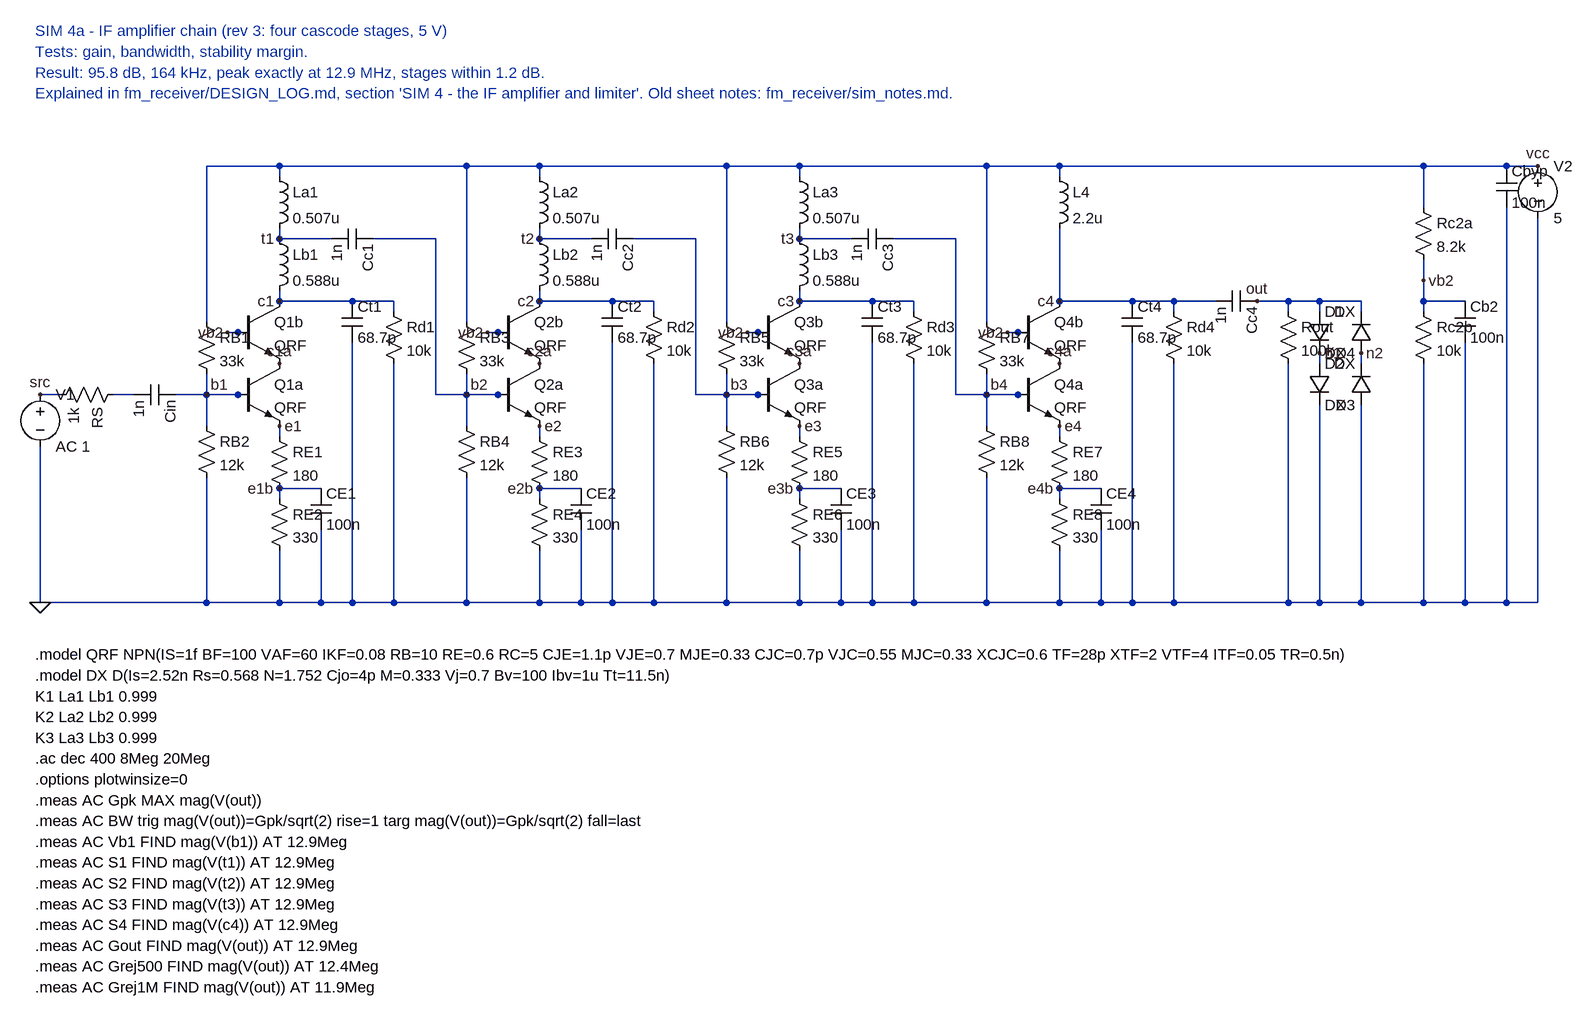
[diagram p0: schematic sim4a_if_gain.asc]
sim4a_if_gain.asc, the LTspice schematic file:
Version 4
SHEET 1 2600 1800
WIRE 336 48 448 48
WIRE 448 48 736 48
WIRE 736 48 848 48
WIRE 848 48 1136 48
WIRE 1136 48 1248 48
WIRE 1248 48 1536 48
WIRE 1536 48 1648 48
WIRE 1648 48 2208 48
WIRE 2208 48 2336 48
WIRE 2336 48 2384 48
WIRE 336 48 336 288
WIRE 448 48 448 64
WIRE 736 48 736 288
WIRE 848 48 848 64
WIRE 1136 48 1136 288
WIRE 1248 48 1248 64
WIRE 1536 48 1536 288
WIRE 1648 48 1648 64
WIRE 2208 48 2208 112
WIRE 80 400 112 400
WIRE 192 400 224 400
WIRE 288 400 336 400
WIRE 80 480 80 720
WIRE 336 368 336 448
WIRE 336 528 336 720
WIRE 336 400 400 400
WIRE 368 304 400 304
WIRE 448 144 448 160
WIRE 448 240 448 256
WIRE 448 256 560 256
WIRE 560 256 624 256
WIRE 624 256 624 272
WIRE 624 352 624 720
WIRE 560 320 560 720
WIRE 448 448 448 464
WIRE 448 544 448 560
WIRE 448 544 512 544
WIRE 448 640 448 720
WIRE 512 608 512 720
WIRE 448 160 528 160
WIRE 592 160 688 160
WIRE 688 160 688 400
WIRE 688 400 736 400
WIRE 736 368 736 448
WIRE 736 528 736 720
WIRE 736 400 800 400
WIRE 768 304 800 304
WIRE 848 144 848 160
WIRE 848 240 848 256
WIRE 848 256 960 256
WIRE 960 256 1024 256
WIRE 1024 256 1024 272
WIRE 1024 352 1024 720
WIRE 960 320 960 720
WIRE 848 448 848 464
WIRE 848 544 848 560
WIRE 848 544 912 544
WIRE 848 640 848 720
WIRE 912 608 912 720
WIRE 848 160 928 160
WIRE 992 160 1088 160
WIRE 1088 160 1088 400
WIRE 1088 400 1136 400
WIRE 1136 368 1136 448
WIRE 1136 528 1136 720
WIRE 1136 400 1200 400
WIRE 1168 304 1200 304
WIRE 1248 144 1248 160
WIRE 1248 240 1248 256
WIRE 1248 256 1360 256
WIRE 1360 256 1424 256
WIRE 1424 256 1424 272
WIRE 1424 352 1424 720
WIRE 1360 320 1360 720
WIRE 1248 448 1248 464
WIRE 1248 544 1248 560
WIRE 1248 544 1312 544
WIRE 1248 640 1248 720
WIRE 1312 608 1312 720
WIRE 1248 160 1328 160
WIRE 1392 160 1488 160
WIRE 1488 160 1488 400
WIRE 1488 400 1536 400
WIRE 1536 368 1536 448
WIRE 1536 528 1536 720
WIRE 1536 400 1600 400
WIRE 1568 304 1600 304
WIRE 1648 144 1648 256
WIRE 1648 256 1760 256
WIRE 1760 256 1824 256
WIRE 1824 256 1824 272
WIRE 1824 352 1824 720
WIRE 1760 320 1760 720
WIRE 1648 448 1648 464
WIRE 1648 544 1648 560
WIRE 1648 544 1712 544
WIRE 1648 640 1648 720
WIRE 1712 608 1712 720
WIRE 1824 256 1888 256
WIRE 1952 256 2000 256
WIRE 2000 256 2048 256
WIRE 2048 256 2112 256
WIRE 2000 256 2000 272
WIRE 2000 352 2000 720
WIRE 2048 256 2048 272
WIRE 2048 336 2048 352
WIRE 2048 416 2048 720
WIRE 2112 256 2112 272
WIRE 2112 352 2112 336
WIRE 2112 416 2112 720
WIRE 2208 192 2208 272
WIRE 2208 256 2272 256
WIRE 2208 352 2208 720
WIRE 2272 320 2272 720
WIRE 2336 112 2336 720
WIRE 2384 128 2384 720
WIRE 80 720 336 720
WIRE 336 720 448 720
WIRE 448 720 512 720
WIRE 512 720 560 720
WIRE 560 720 624 720
WIRE 624 720 736 720
WIRE 736 720 848 720
WIRE 848 720 912 720
WIRE 912 720 960 720
WIRE 960 720 1024 720
WIRE 1024 720 1136 720
WIRE 1136 720 1248 720
WIRE 1248 720 1312 720
WIRE 1312 720 1360 720
WIRE 1360 720 1424 720
WIRE 1424 720 1536 720
WIRE 1536 720 1648 720
WIRE 1648 720 1712 720
WIRE 1712 720 1760 720
WIRE 1760 720 1824 720
WIRE 1824 720 2000 720
WIRE 2000 720 2048 720
WIRE 2048 720 2112 720
WIRE 2112 720 2208 720
WIRE 2208 720 2272 720
WIRE 2272 720 2336 720
WIRE 2336 720 2384 720
FLAG 80 720 0
FLAG 2384 48 vcc
FLAG 80 400 src
FLAG 336 400 b1
FLAG 448 160 t1
FLAG 448 256 c1
FLAG 448 352 c1a
FLAG 448 448 e1
FLAG 448 544 e1b
FLAG 368 304 vb2
FLAG 736 400 b2
FLAG 848 160 t2
FLAG 848 256 c2
FLAG 848 352 c2a
FLAG 848 448 e2
FLAG 848 544 e2b
FLAG 768 304 vb2
FLAG 1136 400 b3
FLAG 1248 160 t3
FLAG 1248 256 c3
FLAG 1248 352 c3a
FLAG 1248 448 e3
FLAG 1248 544 e3b
FLAG 1168 304 vb2
FLAG 1536 400 b4
FLAG 1648 256 c4
FLAG 1648 352 c4a
FLAG 1648 448 e4
FLAG 1648 544 e4b
FLAG 1568 304 vb2
FLAG 1952 256 out
FLAG 2048 336 n1
FLAG 2112 336 n2
FLAG 2208 224 vb2
SYMBOL voltage 80 384 R0
SYMATTR InstName V1
SYMATTR Value AC 1
SYMBOL res 208 384 R90
SYMATTR InstName RS
SYMATTR Value 1k
SYMBOL cap 288 384 R90
SYMATTR InstName Cin
SYMATTR Value 1n
SYMBOL res 320 272 R0
SYMATTR InstName RB1
SYMATTR Value 33k
SYMBOL res 320 432 R0
SYMATTR InstName RB2
SYMATTR Value 12k
SYMBOL npn 384 256 R0
SYMATTR InstName Q1b
SYMATTR Value QRF
SYMBOL npn 384 352 R0
SYMATTR InstName Q1a
SYMATTR Value QRF
SYMBOL ind 432 48 R0
SYMATTR InstName La1
SYMATTR Value 0.507u
SYMBOL ind 432 144 R0
SYMATTR InstName Lb1
SYMATTR Value 0.588u
SYMBOL cap 544 256 R0
SYMATTR InstName Ct1
SYMATTR Value 68.7p
SYMBOL res 608 256 R0
SYMATTR InstName Rd1
SYMATTR Value 10k
SYMBOL res 432 448 R0
SYMATTR InstName RE1
SYMATTR Value 180
SYMBOL res 432 544 R0
SYMATTR InstName RE2
SYMATTR Value 330
SYMBOL cap 496 544 R0
SYMATTR InstName CE1
SYMATTR Value 100n
SYMBOL cap 592 144 R90
SYMATTR InstName Cc1
SYMATTR Value 1n
SYMBOL res 720 272 R0
SYMATTR InstName RB3
SYMATTR Value 33k
SYMBOL res 720 432 R0
SYMATTR InstName RB4
SYMATTR Value 12k
SYMBOL npn 784 256 R0
SYMATTR InstName Q2b
SYMATTR Value QRF
SYMBOL npn 784 352 R0
SYMATTR InstName Q2a
SYMATTR Value QRF
SYMBOL ind 832 48 R0
SYMATTR InstName La2
SYMATTR Value 0.507u
SYMBOL ind 832 144 R0
SYMATTR InstName Lb2
SYMATTR Value 0.588u
SYMBOL cap 944 256 R0
SYMATTR InstName Ct2
SYMATTR Value 68.7p
SYMBOL res 1008 256 R0
SYMATTR InstName Rd2
SYMATTR Value 10k
SYMBOL res 832 448 R0
SYMATTR InstName RE3
SYMATTR Value 180
SYMBOL res 832 544 R0
SYMATTR InstName RE4
SYMATTR Value 330
SYMBOL cap 896 544 R0
SYMATTR InstName CE2
SYMATTR Value 100n
SYMBOL cap 992 144 R90
SYMATTR InstName Cc2
SYMATTR Value 1n
SYMBOL res 1120 272 R0
SYMATTR InstName RB5
SYMATTR Value 33k
SYMBOL res 1120 432 R0
SYMATTR InstName RB6
SYMATTR Value 12k
SYMBOL npn 1184 256 R0
SYMATTR InstName Q3b
SYMATTR Value QRF
SYMBOL npn 1184 352 R0
SYMATTR InstName Q3a
SYMATTR Value QRF
SYMBOL ind 1232 48 R0
SYMATTR InstName La3
SYMATTR Value 0.507u
SYMBOL ind 1232 144 R0
SYMATTR InstName Lb3
SYMATTR Value 0.588u
SYMBOL cap 1344 256 R0
SYMATTR InstName Ct3
SYMATTR Value 68.7p
SYMBOL res 1408 256 R0
SYMATTR InstName Rd3
SYMATTR Value 10k
SYMBOL res 1232 448 R0
SYMATTR InstName RE5
SYMATTR Value 180
SYMBOL res 1232 544 R0
SYMATTR InstName RE6
SYMATTR Value 330
SYMBOL cap 1296 544 R0
SYMATTR InstName CE3
SYMATTR Value 100n
SYMBOL cap 1392 144 R90
SYMATTR InstName Cc3
SYMATTR Value 1n
SYMBOL res 1520 272 R0
SYMATTR InstName RB7
SYMATTR Value 33k
SYMBOL res 1520 432 R0
SYMATTR InstName RB8
SYMATTR Value 12k
SYMBOL npn 1584 256 R0
SYMATTR InstName Q4b
SYMATTR Value QRF
SYMBOL npn 1584 352 R0
SYMATTR InstName Q4a
SYMATTR Value QRF
SYMBOL ind 1632 48 R0
SYMATTR InstName L4
SYMATTR Value 2.2u
SYMBOL cap 1744 256 R0
SYMATTR InstName Ct4
SYMATTR Value 68.7p
SYMBOL res 1808 256 R0
SYMATTR InstName Rd4
SYMATTR Value 10k
SYMBOL res 1632 448 R0
SYMATTR InstName RE7
SYMATTR Value 180
SYMBOL res 1632 544 R0
SYMATTR InstName RE8
SYMATTR Value 330
SYMBOL cap 1696 544 R0
SYMATTR InstName CE4
SYMATTR Value 100n
SYMBOL cap 1952 240 R90
SYMATTR InstName Cc4
SYMATTR Value 1n
SYMBOL res 1984 256 R0
SYMATTR InstName Rout
SYMATTR Value 100k
SYMBOL diode 2032 272 R0
SYMATTR InstName D1
SYMATTR Value DX
SYMBOL diode 2032 352 R0
SYMATTR InstName D2
SYMATTR Value DX
SYMBOL diode 2128 336 R180
SYMATTR InstName D4
SYMATTR Value DX
SYMBOL diode 2128 416 R180
SYMATTR InstName D3
SYMATTR Value DX
SYMBOL res 2192 96 R0
SYMATTR InstName Rc2a
SYMATTR Value 8.2k
SYMBOL res 2192 256 R0
SYMATTR InstName Rc2b
SYMATTR Value 10k
SYMBOL cap 2256 256 R0
SYMATTR InstName Cb2
SYMATTR Value 100n
SYMBOL cap 2320 48 R0
SYMATTR InstName Cbyp
SYMATTR Value 100n
SYMBOL voltage 2384 32 R0
SYMATTR InstName V2
SYMATTR Value 5
TEXT 72 800 Left 2 !.model QRF NPN(IS=1f BF=100 VAF=60 IKF=0.08 RB=10 RE=0.6 RC=5 CJE=1.1p VJE=0.7 MJE=0.33 CJC=0.7p VJC=0.55 MJC=0.33 XCJC=0.6 TF=28p XTF=2 VTF=4 ITF=0.05 TR=0.5n)
TEXT 72 832 Left 2 !.model DX D(Is=2.52n Rs=0.568 N=1.752 Cjo=4p M=0.333 Vj=0.7 Bv=100 Ibv=1u Tt=11.5n)
TEXT 72 864 Left 2 !K1 La1 Lb1 0.999
TEXT 72 896 Left 2 !K2 La2 Lb2 0.999
TEXT 72 928 Left 2 !K3 La3 Lb3 0.999
TEXT 72 960 Left 2 !.ac dec 400 8Meg 20Meg
TEXT 72 992 Left 2 !.options plotwinsize=0
TEXT 72 1024 Left 2 !.meas AC Gpk MAX mag(V(out))
TEXT 72 1056 Left 2 !.meas AC BW trig mag(V(out))=Gpk/sqrt(2) rise=1 targ mag(V(out))=Gpk/sqrt(2) fall=last
TEXT 72 1088 Left 2 !.meas AC Vb1 FIND mag(V(b1)) AT 12.9Meg
TEXT 72 1120 Left 2 !.meas AC S1 FIND mag(V(t1)) AT 12.9Meg
TEXT 72 1152 Left 2 !.meas AC S2 FIND mag(V(t2)) AT 12.9Meg
TEXT 72 1184 Left 2 !.meas AC S3 FIND mag(V(t3)) AT 12.9Meg
TEXT 72 1216 Left 2 !.meas AC S4 FIND mag(V(c4)) AT 12.9Meg
TEXT 72 1248 Left 2 !.meas AC Gout FIND mag(V(out)) AT 12.9Meg
TEXT 72 1280 Left 2 !.meas AC Grej500 FIND mag(V(out)) AT 12.4Meg
TEXT 72 1312 Left 2 !.meas AC Grej1M FIND mag(V(out)) AT 11.9Meg
TEXT 72 -160 Left 2 ;SIM 4a - IF amplifier chain (rev 3: four cascode stages, 5 V)
TEXT 72 -128 Left 2 ;Tests: gain, bandwidth, stability margin.
TEXT 72 -96 Left 2 ;Result: 95.8 dB, 164 kHz, peak exactly at 12.9 MHz, stages within 1.2 dB.
TEXT 72 -64 Left 2 ;Explained in fm_receiver/DESIGN_LOG.md, section 'SIM 4 - the IF amplifier and limiter'. Old sheet notes: fm_receiver/sim_notes.md.

The netlist it stands for:
* sim4a_if_gain.asc
V1 src 0 AC 1
RS N001 src 1k
Cin b1 N001 1n
RB1 vcc b1 33k
RB2 b1 0 12k
Q1b c1 vb2 c1a 0 QRF
Q1a c1a b1 e1 0 QRF
La1 vcc t1 0.507u
Lb1 t1 c1 0.588u
Ct1 c1 0 68.7p
Rd1 c1 0 10k
RE1 e1 e1b 180
RE2 e1b 0 330
CE1 e1b 0 100n
Cc1 b2 t1 1n
RB3 vcc b2 33k
RB4 b2 0 12k
Q2b c2 vb2 c2a 0 QRF
Q2a c2a b2 e2 0 QRF
La2 vcc t2 0.507u
Lb2 t2 c2 0.588u
Ct2 c2 0 68.7p
Rd2 c2 0 10k
RE3 e2 e2b 180
RE4 e2b 0 330
CE2 e2b 0 100n
Cc2 b3 t2 1n
RB5 vcc b3 33k
RB6 b3 0 12k
Q3b c3 vb2 c3a 0 QRF
Q3a c3a b3 e3 0 QRF
La3 vcc t3 0.507u
Lb3 t3 c3 0.588u
Ct3 c3 0 68.7p
Rd3 c3 0 10k
RE5 e3 e3b 180
RE6 e3b 0 330
CE3 e3b 0 100n
Cc3 b4 t3 1n
RB7 vcc b4 33k
RB8 b4 0 12k
Q4b c4 vb2 c4a 0 QRF
Q4a c4a b4 e4 0 QRF
L4 vcc c4 2.2u
Ct4 c4 0 68.7p
Rd4 c4 0 10k
RE7 e4 e4b 180
RE8 e4b 0 330
CE4 e4b 0 100n
Cc4 out c4 1n
Rout out 0 100k
D1 out n1 DX
D2 n1 0 DX
D4 n2 out DX
D3 0 n2 DX
Rc2a vcc vb2 8.2k
Rc2b vb2 0 10k
Cb2 vb2 0 100n
Cbyp vcc 0 100n
V2 vcc 0 5
.model D D
.lib standard.dio
.model NPN NPN
.model PNP PNP
.lib standard.bjt
.model QRF NPN(IS=1f BF=100 VAF=60 IKF=0.08 RB=10 RE=0.6 RC=5 CJE=1.1p VJE=0.7 MJE=0.33 CJC=0.7p VJC=0.55 MJC=0.33 XCJC=0.6 TF=28p XTF=2 VTF=4 ITF=0.05 TR=0.5n)
.model DX D(Is=2.52n Rs=0.568 N=1.752 Cjo=4p M=0.333 Vj=0.7 Bv=100 Ibv=1u Tt=11.5n)
K1 La1 Lb1 0.999
K2 La2 Lb2 0.999
K3 La3 Lb3 0.999
.ac dec 400 8Meg 20Meg
.options plotwinsize=0
.meas AC Gpk MAX mag(V(out))
.meas AC BW trig mag(V(out))=Gpk/sqrt(2) rise=1 targ mag(V(out))=Gpk/sqrt(2) fall=last
.meas AC Vb1 FIND mag(V(b1)) AT 12.9Meg
.meas AC S1 FIND mag(V(t1)) AT 12.9Meg
.meas AC S2 FIND mag(V(t2)) AT 12.9Meg
.meas AC S3 FIND mag(V(t3)) AT 12.9Meg
.meas AC S4 FIND mag(V(c4)) AT 12.9Meg
.meas AC Gout FIND mag(V(out)) AT 12.9Meg
.meas AC Grej500 FIND mag(V(out)) AT 12.4Meg
.meas AC Grej1M FIND mag(V(out)) AT 11.9Meg
* SIM 4a - IF amplifier chain (rev 3: four cascode stages, 5 V)
* Tests: gain, bandwidth, stability margin.
* Result: 95.8 dB, 164 kHz, peak exactly at 12.9 MHz, stages within 1.2 dB.
* Explained in fm_receiver/DESIGN_LOG.md, section 'SIM 4 - the IF amplifier and limiter'. Old sheet notes: fm_receiver/sim_notes.md.
.backanno
.end